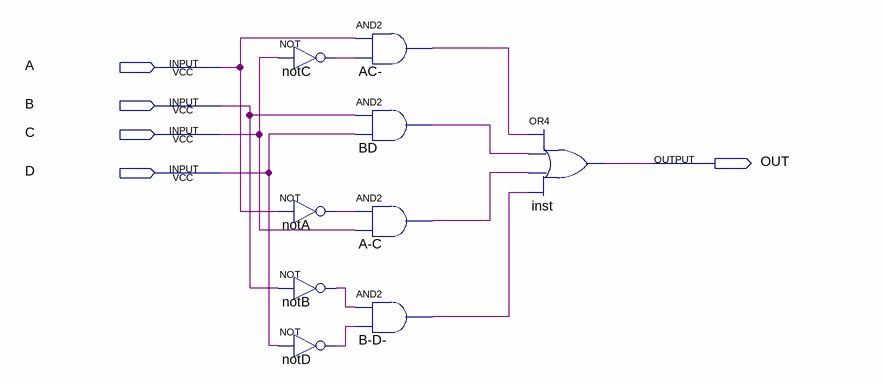
[diagram p0: schematic sheet]
// Quartus schematic a.bdf as structural Verilog: 9 symbols, 5 pins
module a (
  input  A,
  input  B,
  input  C,
  input  D,
  output OUT
);

  wire A_C_out, AC__out, B_D__out, BD_out, notA_out, notB_out, notC_out, notD_out;

  not notC (notC_out, C);
  not notA (notA_out, A);
  not notB (notB_out, B);
  not notD (notD_out, D);
  and \AC-  (AC__out, A, notC_out);
  and BD (BD_out, B, D);
  and \A-C  (A_C_out, notA_out, C);
  and \B-D-  (B_D__out, notB_out, notD_out);
  or inst (OUT, AC__out, BD_out, A_C_out, B_D__out);
endmodule
